# EAGLE design HoneyPI_Platine_2.0_BME680_280_Sensor_Board (EAGLE 9.6.2)
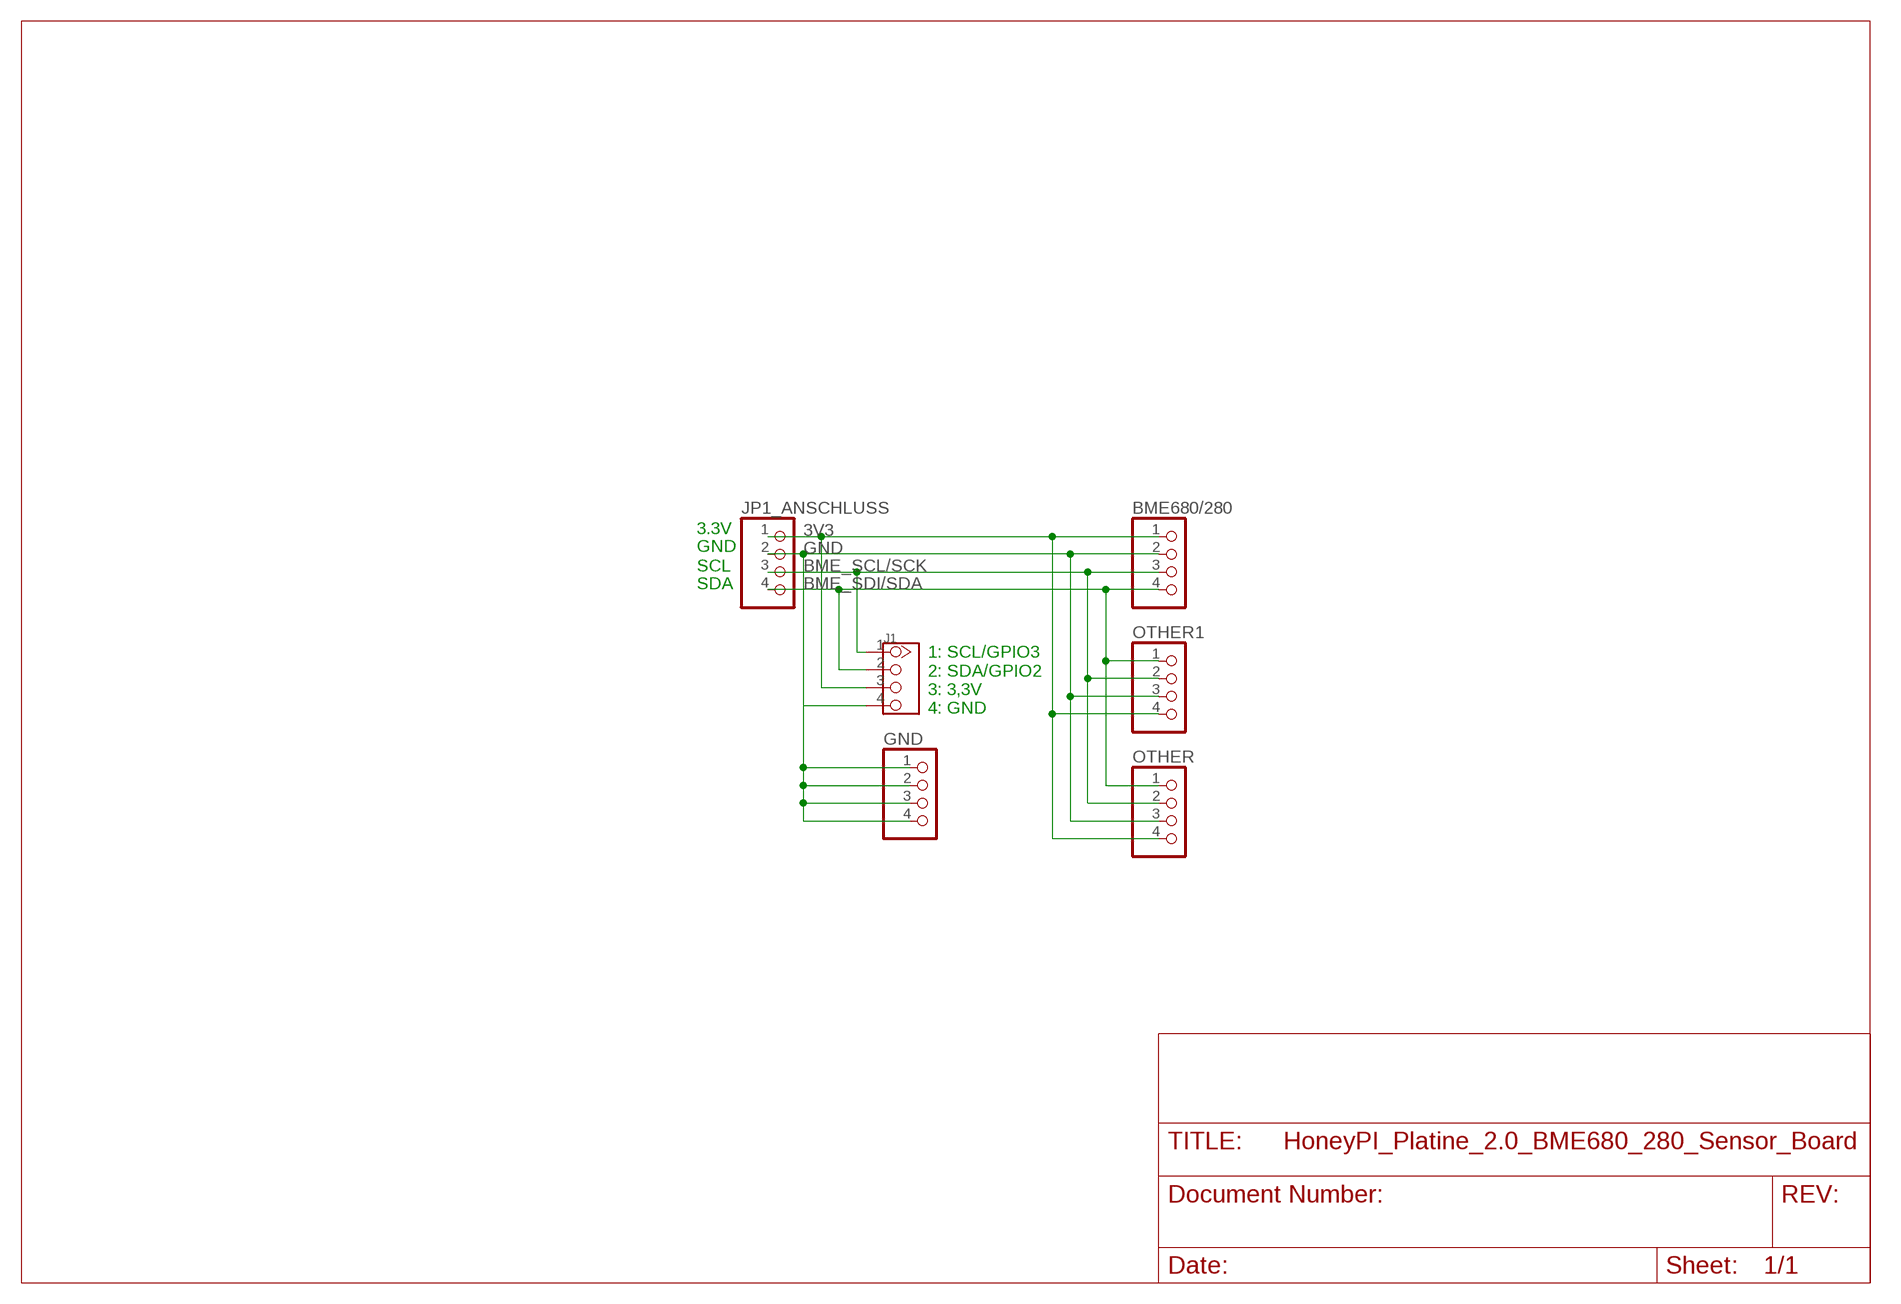
[diagram p0: schematic, sheet 1]

## Parts
BME680/280  PINHD-1X4  [1X04]
GND  PINHD-1X4  [1X04]
J1  TWIG-4P-2.0-2.0  [4P-2.0]
JP1_ANSCHLUSS  PINHD-1X4  [1X04]
OTHER  PINHD-1X4  [1X04]
OTHER1  PINHD-1X4  [1X04]

## Nets
3V3 [Supply3v3]: BME680/280.1 J1.3 JP1_ANSCHLUSS.1 OTHER1.4 OTHER.4
BME_SCL/SCK: BME680/280.3 J1.1 JP1_ANSCHLUSS.3 OTHER1.2 OTHER.2
BME_SDI/SDA: BME680/280.4 J1.2 JP1_ANSCHLUSS.4 OTHER1.1 OTHER.1
GND [Supply5v]: BME680/280.2 GND.1 GND.2 GND.3 GND.4 J1.4 JP1_ANSCHLUSS.2 OTHER1.3 OTHER.3

## Notes on the sheet
- 3.3V
- GND
- SCL
- SDA
- 1: SCL/GPIO3
  2: SDA/GPIO2
  3: 3,3V
  4: GND

## Library data of the parts
BME680/280 GND JP1_ANSCHLUSS OTHER OTHER1 = pinhead:PINHD-1X4: PIN HEADER
J1 = Connector:TWIG-4P-2.0: Grove Stecker RM 2mm 4Pol

## Net classes
0 Signal: width 0.152 mm, clearance 0.305 mm
1 Supply3v3: width 0.25 mm, clearance 0.305 mm
2 Supply5v: width 0.5 mm, clearance 0.305 mm

## Board
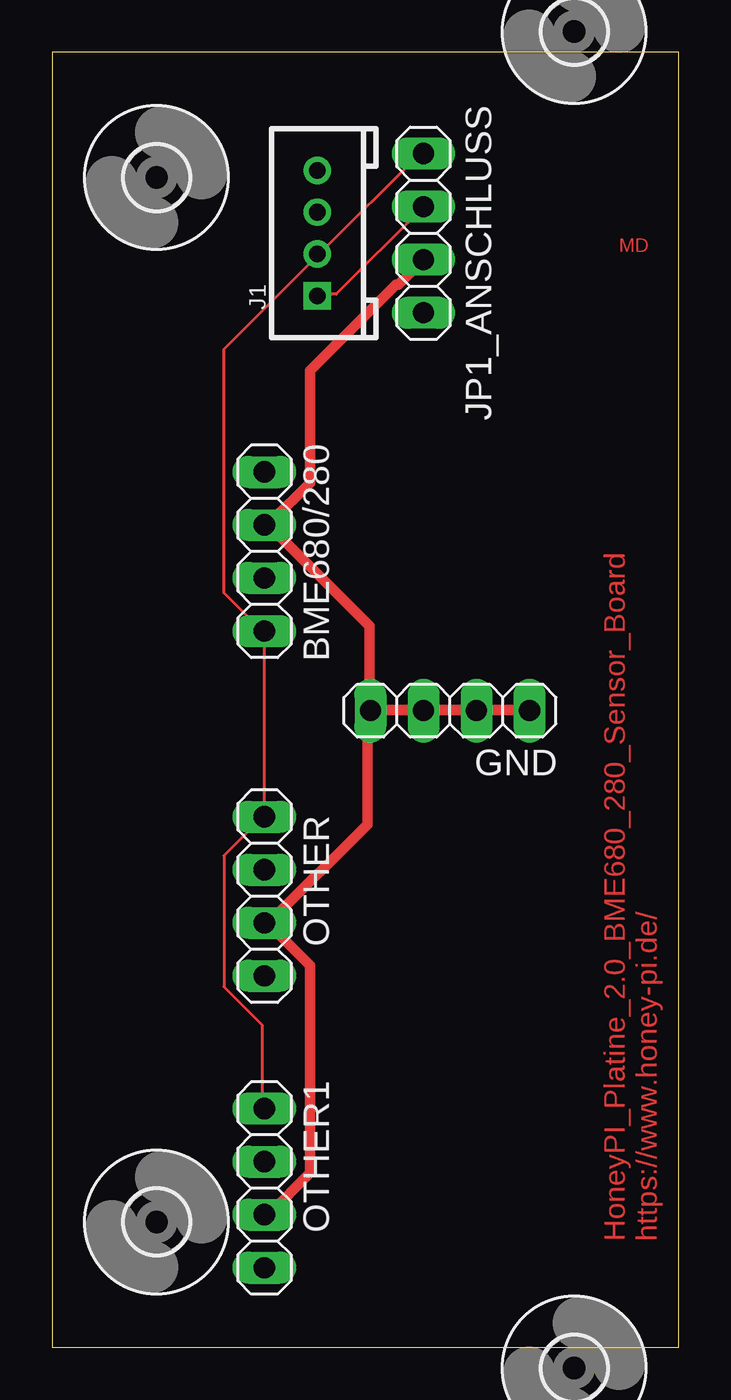
[diagram p1: board, top side]
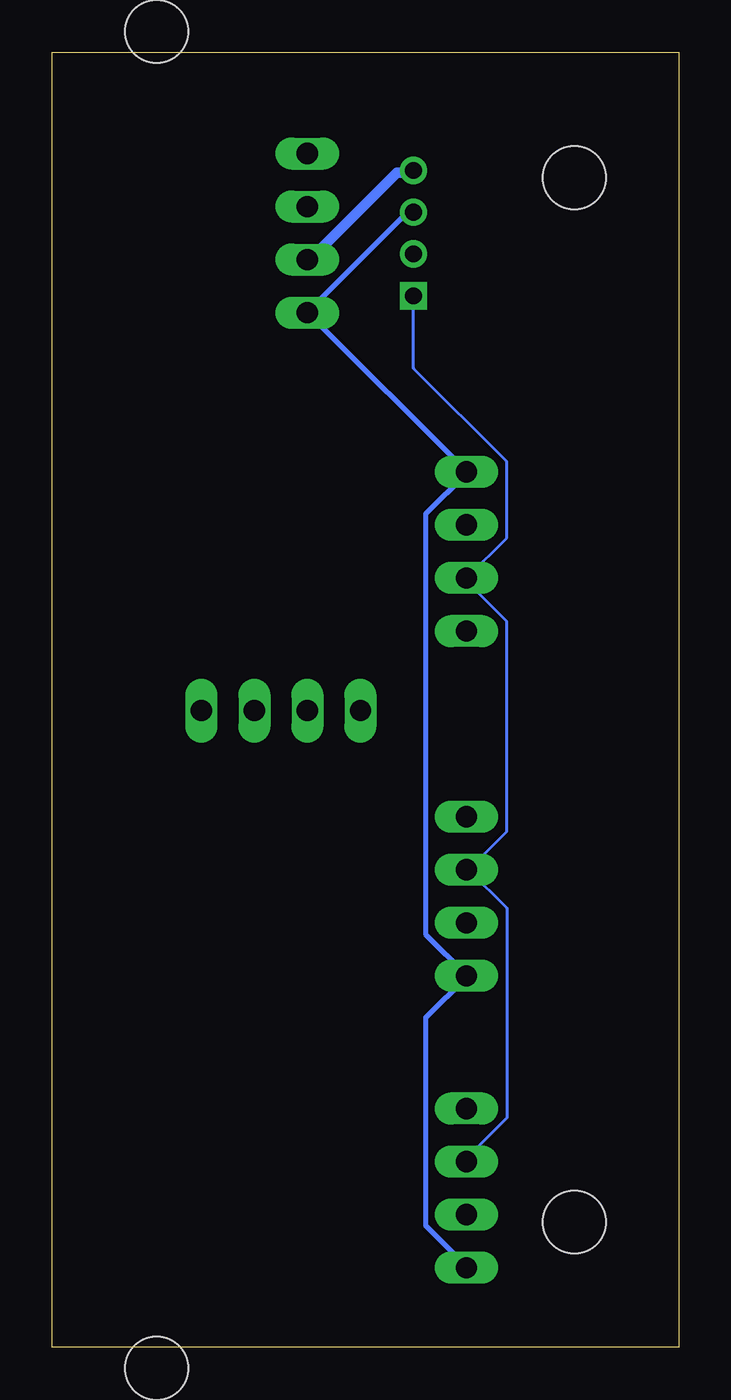
[diagram p2: board, bottom side, seen from below]

Size 30 x 62 mm. Coordinates in mm from the lower left corner, seen from the top.
Outline: 0,0 30,0 30,62 0,62 0,0
Copper layers (1*16): Top 0.035mm / dielectric 1.5mm / Bottom 0.035mm
Design rules "default *": minimum track width 6mil, minimum drill 0.35mm, track to track 6mil, track to pad 6mil, pad to pad 6mil, via to via 6mil, smd to smd 6mil, copper to edge 40mil, drill to drill 1mm, minimum pad ring 10mil, minimum via ring 8mil, stop-mask expansion 4mil, vias tented up to drill 0mil, thermal gap 10mil

### Footprints (pad centres in the part's own frame; a part is rotated, then mirrored left to right if it is on the bottom)
1X04 = drill 1.016 long: 1 -3.81,0; 2 -1.27,0; 3 1.27,0; 4 3.81,0
4P-2.0 = drill 0.8 pad 1.27 square: 1 -3,0 | drill 0.8 pad 1.27: 2 -1,0; 3 1,0; 4 3,0
3,0 = hole 3: 0,0

### Placement (x,y rotation side)
BME680/280  10.16,38.1 270 top
GND  19.05,30.48 180 top
J1  12.7,53.34 90 top
JP1_ANSCHLUSS  17.78,53.34 90 top
OTHER  10.16,21.59 270 top
OTHER1  10.16,7.62 270 top
U$1  [3,0]  25,63 0 top
U$2  [3,0]  5,56 0 top
U$3  [3,0]  25,-1 0 top
U$4  [3,0]  5,6 0 top

### Tracks (layer width: path | path; a pad name or v marks a point on that pad's centre or on a via)
3V3
  Bottom 0.25: OTHER1.4 10.17,3.89 12.12,5.83 12.12,15.77 10.17,17.72 OTHER.4 10.17,17.83 12.12,19.77 12.12,39.89 10.17,41.83 BME680/280.1 10.17,41.95 17.72,49.49 JP1_ANSCHLUSS.1 17.72,49.61 13.03,54.29 12.8,54.29 J1.3
BME_SCL/SCK
  Top 0.152: J1.1 12.8,50.41 13.6,50.41 17.72,54.52 JP1_ANSCHLUSS.3
  Bottom 0.152: 10.06,22.86 8.23,21.03 8.23,10.97 10.06,9.14 10.06,8.91 OTHER1.2 | 10.06,22.86 8.23,24.69 8.23,34.75 10.06,36.58 10.06,36.8 BME680/280.3 10.06,36.92 8.23,38.75 8.23,42.41 12.69,46.86 12.69,50.29 J1.1 | 10.06,22.86 OTHER.2
BME_SDI/SDA
  Top 0.152: JP1_ANSCHLUSS.4 17.6,57.15 12.8,52.35 J1.2 12.69,52.23 8.23,47.78 8.23,36.12 10.06,34.29 BME680/280.4 10.17,34.29 10.17,25.49 OTHER.1 10.06,25.38 8.23,23.55 8.23,17.26 10.06,15.43 10.06,11.43 OTHER1.1
GND
  Top 0.5: OTHER1.3 10.17,6.4 10.4,6.4 12.34,8.34 12.34,18.29 10.4,20.23 10.17,20.23 OTHER.3 10.52,20.46 15.09,25.03 15.09,30.29 GND.4 | GND.4 15.32,30.52 17.72,30.52 GND.3 17.95,30.52 20.23,30.52 GND.2 20.57,30.52 22.86,30.52 GND.1 | GND.4 15.2,30.75 15.2,34.52 10.4,39.32 10.17,39.32 BME680/280.2 10.52,39.55 12.34,41.38 12.34,46.75 16.46,50.86 16.57,50.86 JP1_ANSCHLUSS.2
  Bottom 0.5: J1.4 12.8,56.24 13.49,56.24 17.72,52.01 JP1_ANSCHLUSS.2

### Text on the board
Top: MD | HoneyPI_Platine_2.0_BME680_280_Sensor_Board / https://www.honey-pi.de/